# Altium project PCB_Project1.PrjPCB
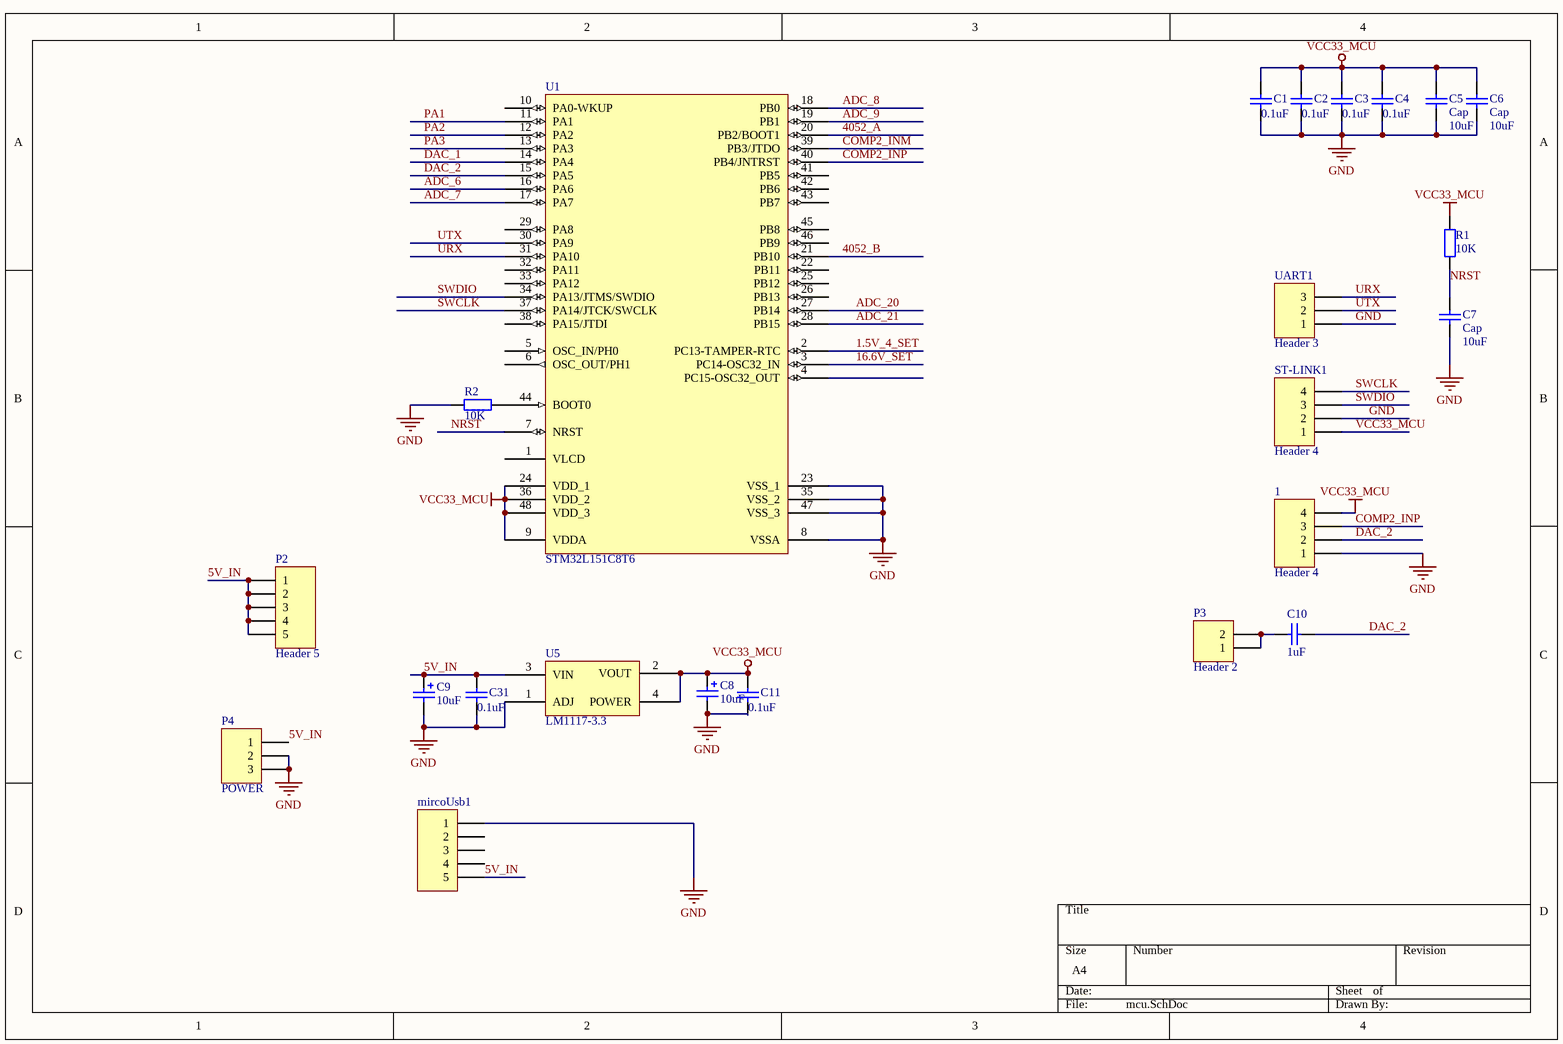
[diagram p0: mcu.SchDoc]
4 sheets, 110 parts. Net scope: global (net labels, ports and power ports of the same name join across sheets).
Board file: PCB1.PcbDoc
Sheets:
  mcu.SchDoc
  SIGNAL.SchDoc
  POWER.SchDoc
  NEW_POWER.SchDoc

## Sheet mcu.SchDoc
size A4

### Parts
1  Header 4  [HDR1X4]
C1  value 0.1uF  [c0805]  (hidden comment: Cap)
C2  value 0.1uF  [c0805]  (hidden comment: Cap)
C3  value 0.1uF  [c0805]  (hidden comment: Cap)
C4  value 0.1uF  [c0805]  (hidden comment: Cap)
C5  Cap  value 10uF  [c0805]
C6  Cap  value 10uF  [c0805]
C7  Cap  value 10uF  [c0805]
C8  value 10uF  [C1206]  (hidden comment: Cap Pol2)
C9  value 10uF  [C1206]  (hidden comment: Cap Pol2)
C10  value 1uF  [0805]  (hidden comment: Cap)
C11  value 0.1uF  [0805]  (hidden comment: Cap)
C31  value 0.1uF  [0805]  (hidden comment: Cap)
mircoUsb1  (no value)  [Micro_USB]
P2  Header 5  [HDR1X5]
P3  Header 2  [HDR1X2]
P4  POWER  [POWER_PLUG]
R1  value 10K  [0805]  (hidden comment: Res2)
R2  value 10K  [0805]  (hidden comment: Res2)
ST-LINK1  Header 4  [HDR1X4]
U1  STM32L151C8T6  [LQFP48_N]
U5  LM1117-3.3  [SOT223]
UART1  Header 3  [HDR1X3]

### Nets
GND: 1.1 C1.1 C2.1 C3.1 C4.1 C5.1 C6.1 C7.1 C8.2 C9.2 C11.1 C31.1 mircoUsb1.1 P4.2 P4.3 R2.1 ST-LINK1.2 U1.8(VSSA) U1.23(VSS_1) U1.35(VSS_2) U1.47(VSS_3) U5.1(ADJ) UART1.1
VCC33_MCU: 1.4 C1.2 C2.2 C3.2 C4.2 C5.2 C6.2 C8.1 C11.2 R1.1 ST-LINK1.1 U1.9(VDDA) U1.24(VDD_1) U1.36(VDD_2) U1.48(VDD_3) U5.2(VOUT) U5.4(POWER)
1.5V_4_SET: U1.2(PC13-TAMPER-RTC)
5V_IN: C9.1 C31.2 mircoUsb1.5 P2.1 P2.2 P2.3 P2.4 P2.5 P4.1 U5.3(VIN)
16.6V_SET: U1.3(PC14-OSC32_IN)
4052_A: U1.20(PB2/BOOT1)
4052_B: U1.21(PB10)
ADC_6: U1.16(PA6)
ADC_7: U1.17(PA7)
ADC_8: U1.18(PB0)
ADC_9: U1.19(PB1)
ADC_20: U1.27(PB14)
ADC_21: U1.28(PB15)
COMP2_INM: U1.39(PB3/JTDO)
COMP2_INP: 1.3 U1.40(PB4/JNTRST)
DAC_1: U1.14(PA4)
DAC_2: 1.2 C10.1 U1.15(PA5)
NRST: C7.2 R1.2 U1.7(NRST)
PA1: U1.11(PA1)
PA2: U1.12(PA2)
PA3: U1.13(PA3)
SWCLK: ST-LINK1.4 U1.37(PA14/JTCK/SWCLK)
SWDIO: ST-LINK1.3 U1.34(PA13/JTMS/SWDIO)
URX: U1.31(PA10) UART1.3
UTX: U1.30(PA9) UART1.2
NetC10_2: C10.2 P3.1 P3.2
NetR2_2: R2.2 U1.44(BOOT0)

Not connected (* = marked no-connect by the designer): mircoUsb1 2 3 4; U1 1(VLCD) 4(PC15-OSC32_OUT) 5(OSC_IN/PH0) 6(OSC_OUT/PH1) 10(PA0-WKUP) 22(PB11) 25(PB12) 26(PB13) 29(PA8) 32(PA11) 33(PA12) 38(PA15/JTDI) 41(PB5) 42(PB6) 43(PB7) 45(PB8) 46(PB9)

### Library data of the parts
1 ST-LINK1 = Header 4: Header, 4-Pin; LatestRevisionDate: 17-Jul-2002; LatestRevisionNote: Re-released for DXP Platform.; Publisher: Altium Limited
C1-C7 C10 C11 C31 = Cap: Capacitor; Published: 8-Jun-2000; LatestRevisionDate: 17-Jul-2002; LatestRevisionNote: Re-released for DXP Platform.; PackageReference: RAD-0.3; Publisher: Altium Limited
  C5-C7: PackageDescription: Radial Cap, Thru-Hole; 2 Leads; 0.3 in Pin Spacing
C8 C9 = Cap Pol2: Polarized Capacitor (Axial); Published: 8-Jun-2000; LatestRevisionDate: 17-Jul-2002; LatestRevisionNote: Re-released for DXP Platform.; PackageReference: POLAR0.8; Publisher: Altium Limited
mircoUsb1 P2 = Header 5: Header, 5-Pin; LatestRevisionDate: 17-Jul-2002; LatestRevisionNote: Re-released for DXP Platform.; Publisher: Altium Limited
P3 = Header 2: Header, 2-Pin; LatestRevisionDate: 17-Jul-2002; LatestRevisionNote: Re-released for DXP Platform.; Publisher: Altium Limited
R1 R2 = Res2: Resistor; Published: 8-Jun-2000; LatestRevisionDate: 17-Jul-2002; LatestRevisionNote: Re-released for DXP Platform.; PackageReference: AXIAL-0.4; Publisher: Altium Limited
U1 = STM32L151C8T6: STM32 ARM-based 32-bit MCU with 64 Kbytes Flash, 48-pin LQFP, Industrial Temperature; Published: 30-May-2008; DatasheetVersion: rev6, Mar-2008; PackageVersion: Mar-2008; PackageReference: LQFP48; Publisher: Altium Limited; PackageDescription: 48-Pin Low-Profile Quad Flat Pack, 7 x 7 mm Body, 0.5 mm Pitch (LQFP48); ComponentLink1Description: Manufacturer Link; ComponentLink1URL: www.st.com/stm32; ComponentLink2Description: Datasheet; ComponentLink2URL: http://www.st.com/stonline/products/literature/ds/13586.pdf
UART1 = Header 3: Header, 3-Pin; LatestRevisionDate: 17-Jul-2002; LatestRevisionNote: Re-released for DXP Platform.; Publisher: Altium Limited

## Sheet SIGNAL.SchDoc
size A4
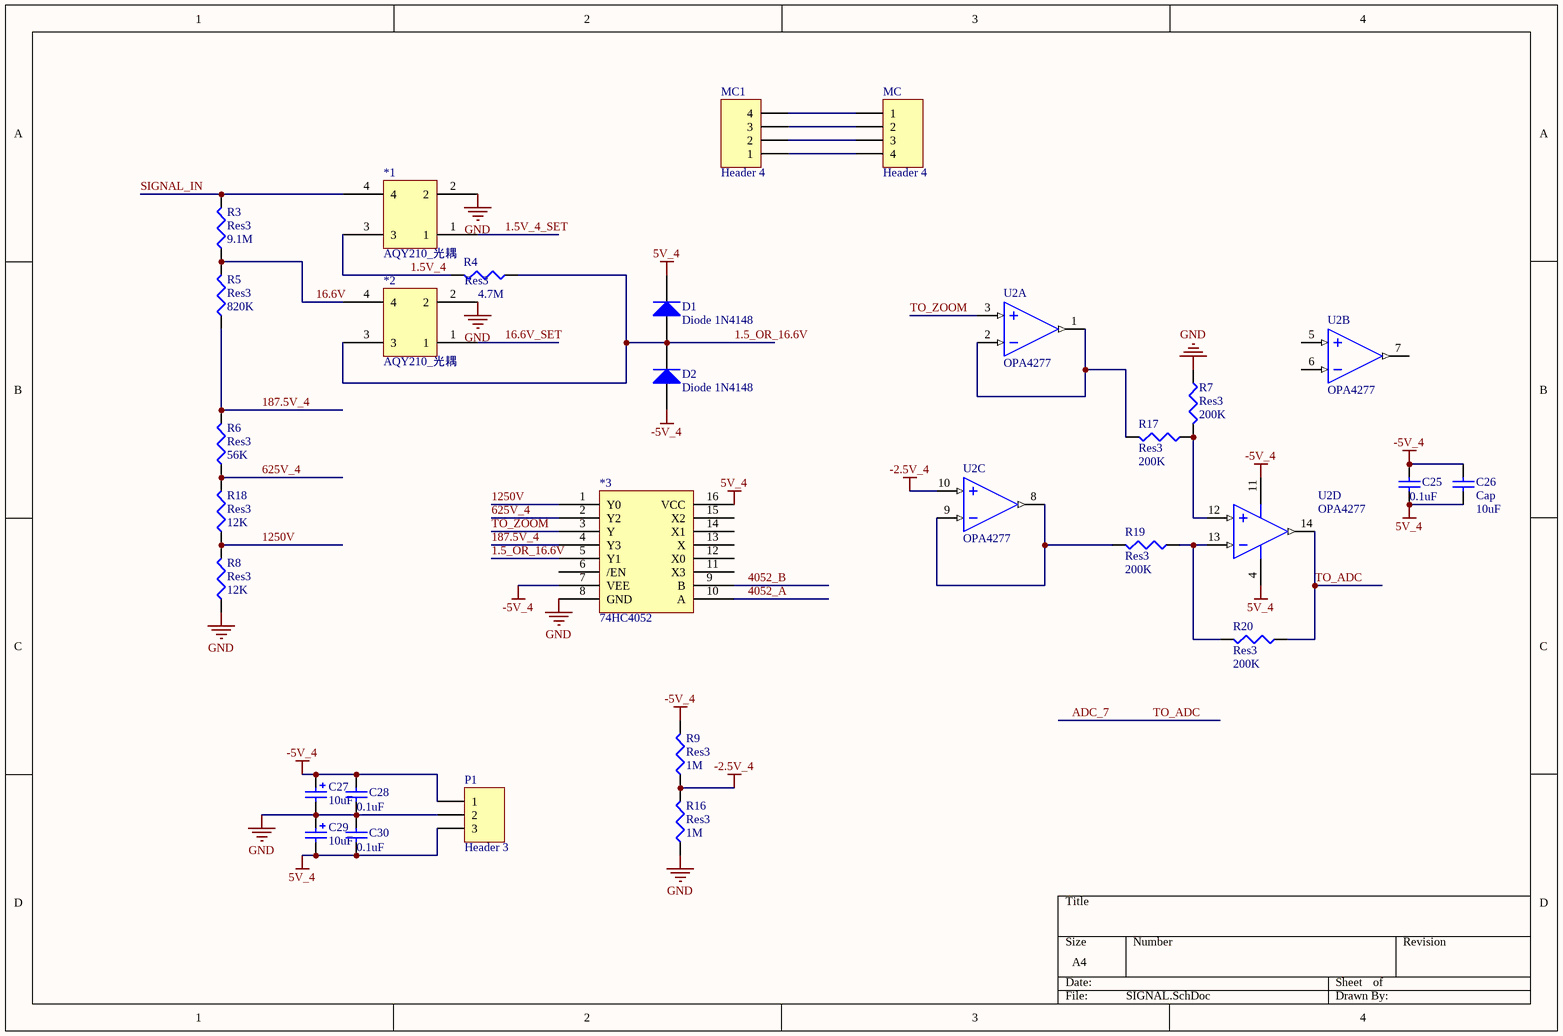
[diagram p1: SIGNAL.SchDoc]

### Parts
*1  AQY210_光耦  [SOT254P605X218-4N]
*2  AQY210_光耦  [SOT254P605X218-4N]
*3  74HC4052  [SOP-16]
C25  value 0.1uF  [c0805]  (hidden comment: Cap)
C26  Cap  value 10uF  [c0805]
C27  value 10uF  [C1206]  (hidden comment: Cap Pol2)
C28  value 0.1uF  [0805]  (hidden comment: Cap)
C29  value 10uF  [C1206]  (hidden comment: Cap Pol2)
C30  value 0.1uF  [0805]  (hidden comment: Cap)
D1  Diode 1N4148  [0805]
D2  Diode 1N4148  [0805]
MC  Header 4  [PCBComponent_1]
MC1  Header 4  [HDR1X4]
P1  Header 3  [HDR1X3]
R3  Res3  value 9.1M  [0805]
R4  Res3  value 4.7M  [0805]
R5  Res3  value 820K  [0805]
R6  Res3  value 56K  [0805]
R7  Res3  value 200K  [0805]
R8  Res3  value 12K  [0805]
R9  Res3  value 1M  [0805]
R16  Res3  value 1M  [0805]
R17  Res3  value 200K  [0805]
R18  Res3  value 12K  [0805]
R19  Res3  value 200K  [0805]
R20  Res3  value 200K  [0805]
U2  OPA4277  [SO-14]  (parts A,B,C,D of 4)

### Nets
5V_4: *3.16(VCC) C25.1 C26.1 C29.2 C30.1 D1.2(K) P1.3 U2.4(V+)
-2.5V_4: R9.1 R16.2 U2.10(IN+)
-5V_4: *3.7(VEE) C25.2 C26.2 C27.1 C28.2 D2.1(A) P1.1 R9.2 U2.11(V-)
GND: *1.2 *2.2 *3.8(GND) C27.2 C28.1 C29.1 C30.2 P1.2 R7.1 R8.1 R16.1
1.5_OR_16.6V: *2.3 *3.5(Y1) D1.1(A) D2.2(K) R4.1
1.5V_4: *1.3 R4.2
1.5V_4_SET: *1.1
16.6V: *2.4 R3.1 R5.2
16.6V_SET: *2.1
187.5V_4: *3.4(Y3) R5.1 R6.2
625V_4: *3.2(Y2) R6.1 R18.2
1250V: *3.1(Y0) R8.2 R18.1
4052_A: *3.10(A)
4052_B: *3.9(B)
ADC_7: R20.1 U2.14(OUT)  [also labelled TO_ADC]
SIGNAL_IN: *1.4 R3.2
TO_ZOOM: *3.3(Y) U2.3(IN+)
NetMC_1: MC.1 MC1.4
NetMC_2: MC.2 MC1.3
NetMC_3: MC.3 MC1.2
NetMC_4: MC.4 MC1.1
NetR7_2: R7.2 R17.1 U2.12(IN+)
NetR17_2: R17.2 U2.1(OUT) U2.2(IN-)
NetR19_1: R19.1 R20.2 U2.13(IN-)
NetR19_2: R19.2 U2.8(OUT) U2.9(IN-)

Not connected (* = marked no-connect by the designer): *3 6(/EN) 11(X3) 12(X0) 13(X) 14(X1) 15(X2); U2 5(IN+) 6(IN-) 7(OUT)

### Library data of the parts
*1 *2 = AQY210_光耦: AQY210
C25 C26 C28 C30 = Cap: Capacitor; Published: 8-Jun-2000; LatestRevisionDate: 17-Jul-2002; LatestRevisionNote: Re-released for DXP Platform.; PackageReference: RAD-0.3; Publisher: Altium Limited
  C26: PackageDescription: Radial Cap, Thru-Hole; 2 Leads; 0.3 in Pin Spacing
C27 C29 = Cap Pol2: Polarized Capacitor (Axial); Published: 8-Jun-2000; LatestRevisionDate: 17-Jul-2002; LatestRevisionNote: Re-released for DXP Platform.; PackageReference: POLAR0.8; Publisher: Altium Limited
D1 D2 = Diode 1N4002: 1 Amp General Purpose Rectifier; Published: 8-Jun-2000; LatestRevisionDate: 17-Jul-2002; LatestRevisionNote: Re-released for DXP Platform.; DatasheetVersion: 1998; PackageVersion: Aug-1999; PackageReference: DO-41; Publisher: Altium Limited; PackageDescription: Diode, Axial; Body 5.2 x 2.7 mm (LxDia. max), Lead Dia. 0.86 mm (max); Code_JEDEC: DO-204-AL; ComponentLink1Description: Manufacturer Link; ComponentLink1URL: http://www.fairchildsemi.com/; ComponentLink2Description: Datasheet; ComponentLink2URL: http://www.fairchildsemi.com/ds/1N%2F1N4001.pdf
MC MC1 = Header 4: Header, 4-Pin; LatestRevisionDate: 17-Jul-2002; LatestRevisionNote: Re-released for DXP Platform.; Publisher: Altium Limited
P1 = Header 3: Header, 3-Pin; LatestRevisionDate: 17-Jul-2002; LatestRevisionNote: Re-released for DXP Platform.; Publisher: Altium Limited
R3-R9 R16-R20 = Res3: Resistor; Published: 8-Jun-2000; LatestRevisionDate: 29-May-2009; LatestRevisionNote: IPC-7351 Footprint Added.; PackageReference: J1-0603; Publisher: Altium Limited; PackageDescription: Chip Resistor
U2 = OPA4277: High Precision Operational Amplifiers; Text Field7: Published 8-Jun-2000

## Sheet POWER.SchDoc
size A4
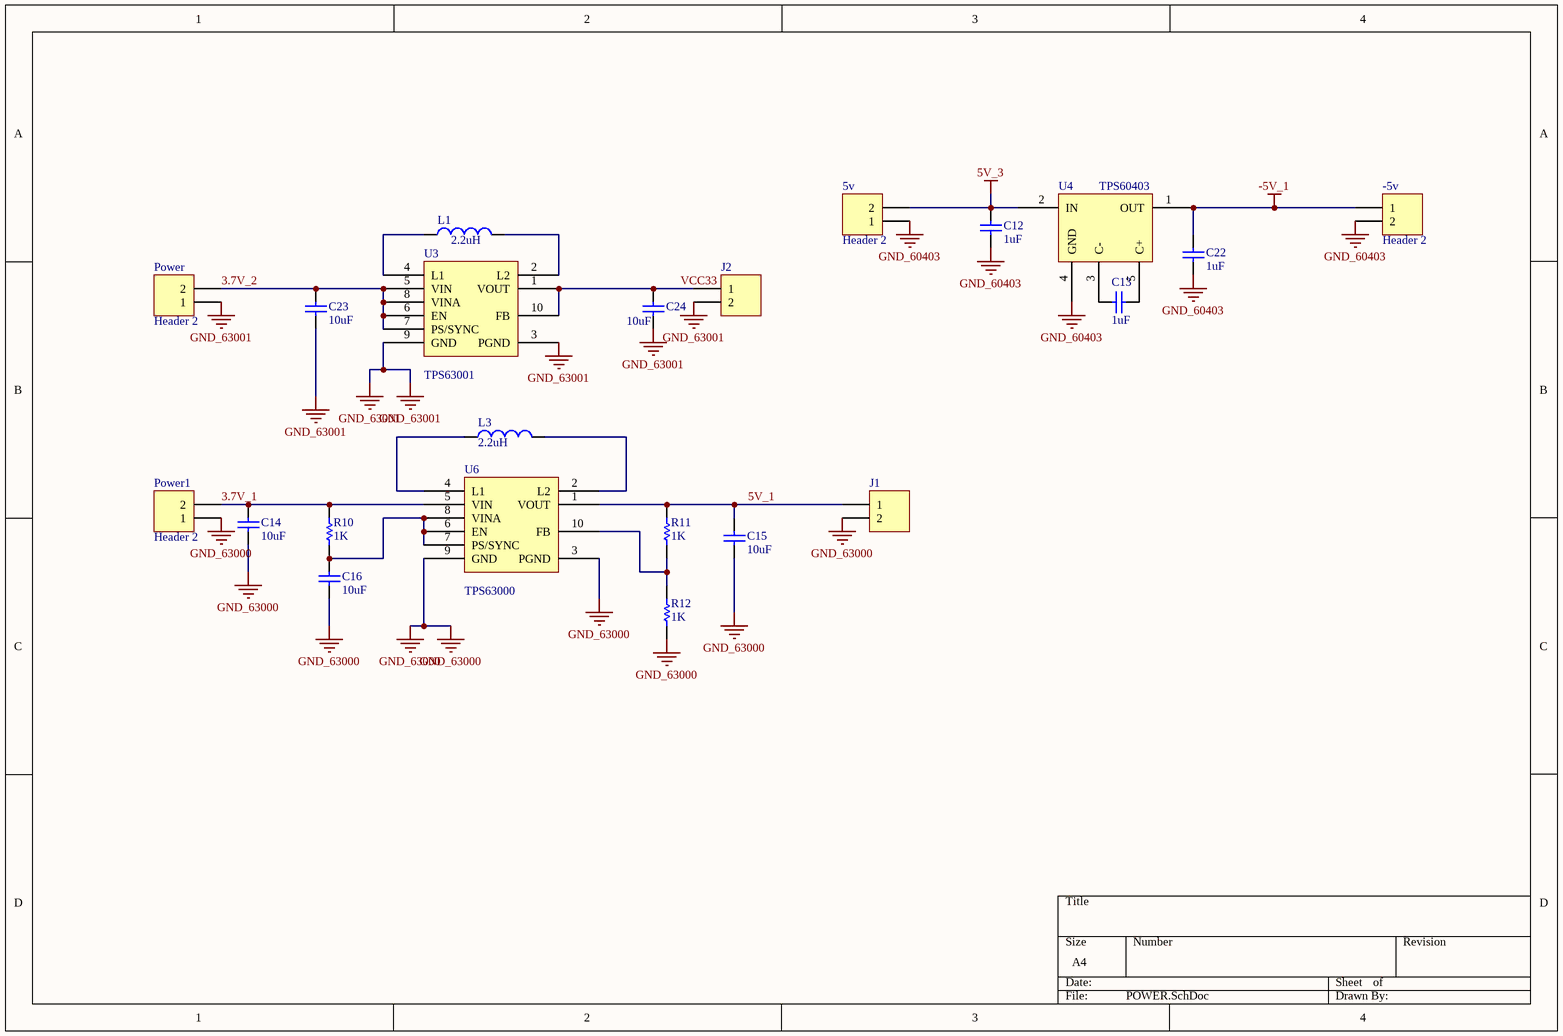
[diagram p2: POWER.SchDoc]

### Parts
5v  Header 2  [HDR1X2]
-5v  Header 2  [HDR1X2]
C12  value 1uF  [PCBComponent_1]
C13  value 1uF  [PCBComponent_1]
C14  value 10uF  [PCBComponent_1]
C15  value 10uF  [PCBComponent_1]
C16  value 10uF  [PCBComponent_1]
C22  value 1uF  [PCBComponent_1]
C23  value 10uF  [PCBComponent_1]
C24  value 10uF  [PCBComponent_1]
J1  (no value)  [HDR1X2]
J2  (no value)  [HDR1X2]
L1  value 2.2uH  [INDP7474X40N]
L3  value 2.2uH  [INDP7474X40N]
Power  Header 2  [HDR1X2]
Power1  Header 2  [HDR1X2]
R10  value 1K  [2012[0805]]
R11  value 1K  [2012[0805]]
R12  value 1K  [2012[0805]]
U3  TPS63001  [QFN50P300X300X95-10M]
U4  TPS60403  [SOT95P280X110-5N]
U6  TPS63000  [QFN50P300X300X95-10M]

### Nets
5V_3: 5v.2 C12.1 U4.2(IN)
-5V_1: -5v.1 C22.1 U4.1(OUT)
GND_60403: 5v.1 -5v.2 C12.2 C22.2 U4.4(GND)
GND_63000: C14.1 C15.1 C16.1 J1.2 Power1.1 R12.1 U6.3(PGND) U6.9(GND)
GND_63001: C23.1 C24.1 J2.2 Power.1 U3.3(PGND) U3.9(GND)
3.7V_1: C14.2 Power1.2 R10.2 U6.5(VIN)
3.7V_2: C23.2 Power.2 U3.5(VIN) U3.6(EN) U3.7(PS/SYNC) U3.8(VINA)
5V_1: C15.2 J1.1 R11.2 U6.1(VOUT)
VCC33: C24.2 J2.1 U3.1(VOUT) U3.10(FB)
NetC13_1: C13.1 U4.5(C+)
NetC13_2: C13.2 U4.3(C-)
NetC16_2: C16.2 R10.1 U6.6(EN) U6.7(PS/SYNC) U6.8(VINA)
NetL1_1: L1.1 U3.4(L1)
NetL1_2: L1.2 U3.2(L2)
NetL3_1: L3.1 U6.4(L1)
NetL3_2: L3.2 U6.2(L2)
NetR11_1: R11.1 R12.2 U6.10(FB)

### Library data of the parts
5v -5v J1 J2 Power Power1 = Header 2: Header, 2-Pin; LatestRevisionDate: 17-Jul-2002; LatestRevisionNote: Re-released for DXP Platform.; Publisher: Altium Limited
C12-C16 C22-C24 = Cap Semi: Capacitor (Semiconductor SIM Model); Published: 8-Jun-2000; LatestRevisionDate: 17-Jul-2002; LatestRevisionNote: Re-released for DXP Platform.; PackageReference: C1206; Publisher: Altium Limited
L1 L3 = Inductor: Code_IEC: 1005; Published: 8-Jun-2000; LatestRevisionDate: 17-Jul-2002; LatestRevisionNote: Re-released for DXP Platform.; PackageReference: 0402-A; Publisher: Altium Limited; Code_JEITA: 0402
R10-R12 = Res Semi: Semiconductor Resistor; Published: 8-Jun-2000; LatestRevisionDate: 17-Jul-2002; LatestRevisionNote: Re-released for DXP Platform.; PackageReference: AXIAL-0.5; Publisher: Altium Limited
U3 U4 U6 = Component_1

## Sheet NEW_POWER.SchDoc
size A4
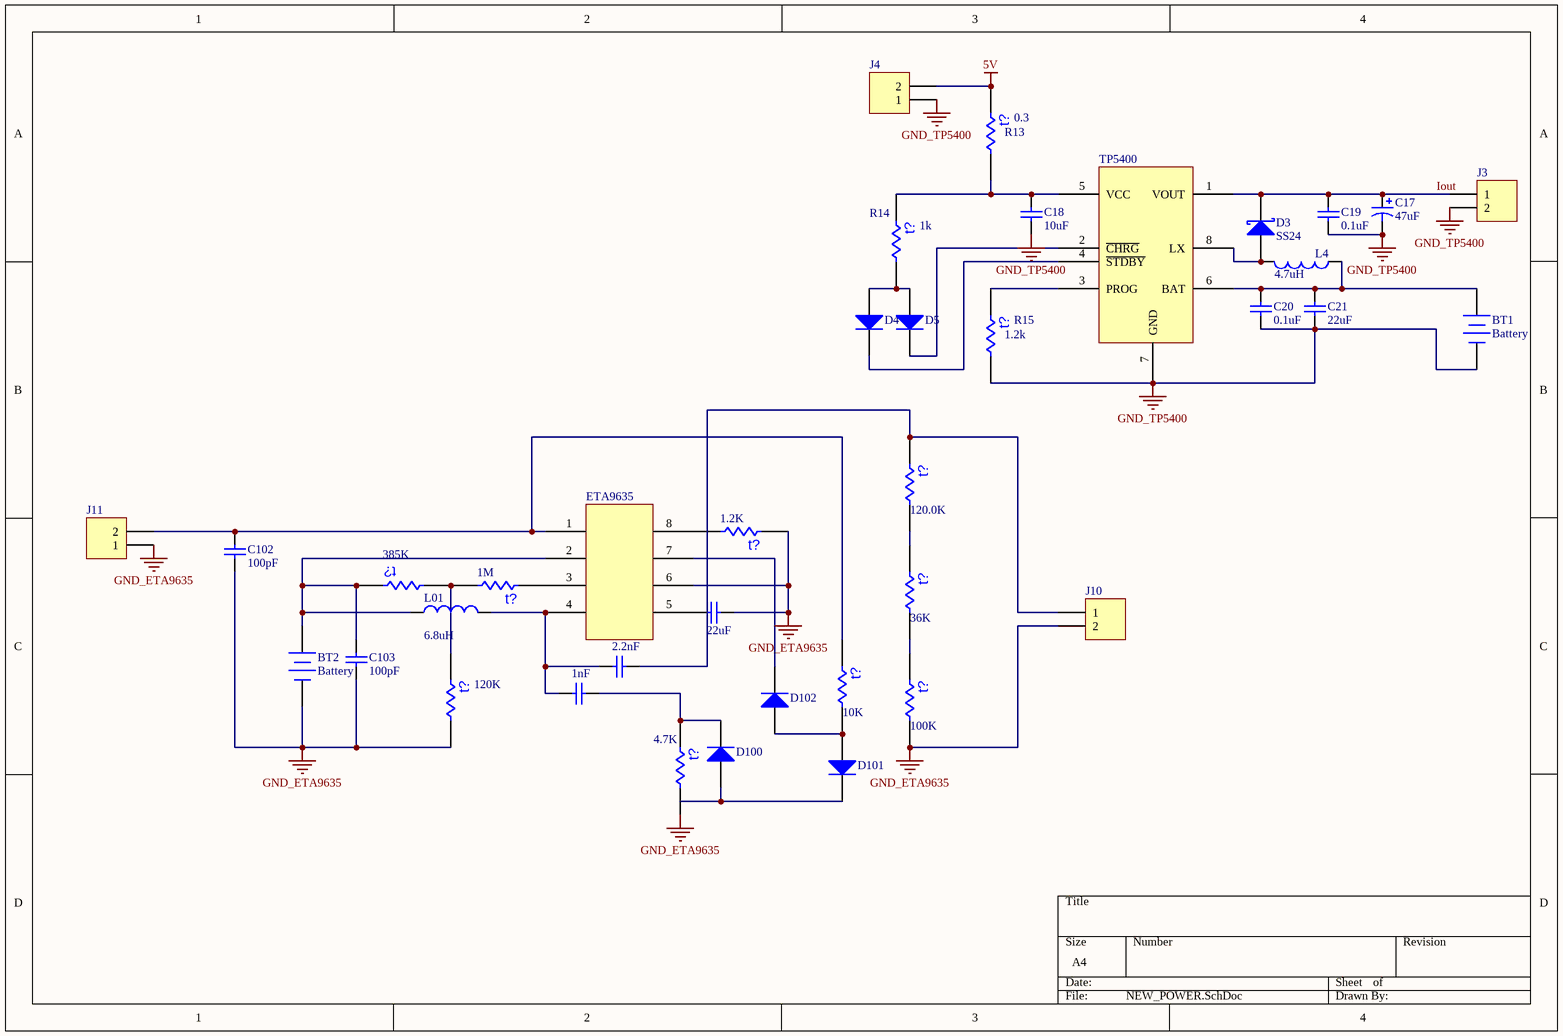
[diagram p3: NEW_POWER.SchDoc]

### Parts
1.2K  (no value)  [6-0805]
1M  (no value)  [6-0805]
1nF  (no value)  [PCBComponent_1]
2.2nF  (no value)  [PCBComponent_1]
4.7K  (no value)  [6-0805]
10K  (no value)  [6-0805]
36K  (no value)  [6-0805]
100K  (no value)  [6-0805]
120.0K  (no value)  [6-0805]
120K  (no value)  [6-0805]
385K  (no value)  [6-0805]
BT1  Battery  [BAT-2]
BT2  Battery  [BAT-2]
C17  value 47uF  [3225[1210]]
C18  value 10uF  [PCBComponent_1]
C19  value 0.1uF  [PCBComponent_1]
C20  value 0.1uF  [PCBComponent_1]
C21  value 22uF  [C1210]
C102  value 100pF  [PCBComponent_1]
C103  value 100pF  [PCBComponent_1]
D3  SS24  [CAPM4227X18N]
D4  (no value)  [PCBComponent_1]
D5  (no value)  [PCBComponent_1]
D100  (no value)  [PCBComponent_1]
D101  (no value)  [PCBComponent_1]
D102  (no value)  [PCBComponent_1]
ETA9635  (no value)  [SOP-8]
J3  (no value)  [HDR1X2]
J4  (no value)  [HDR1X2]
J10  (no value)  [HDR1X2]
J11  (no value)  [HDR1X2]
L01  value 6.8uH  [INDP7474X40N]
L4  value 4.7uH  [INDP7474X40N]
R13  0.3  [6-0805]
R14  1k  [6-0805]
R15  1.2k  [6-0805]
TP5400  (no value)  [SOP127P600X175-8N]
  value 22uF  [PCBComponent_1]

### Nets
5V: J4.2 R13.1
GND_ETA9635: 1.2K.1 4.7K.2 100K.2 120K.2 BT2.2(-) C102.1 C103.1 ETA9635.6 J10.2 J11.1 .1
GND_TP5400: BT1.2(-) C17.2 C18.1 C19.1 C20.1 C21.1 J3.2 J4.1 R15.2 TP5400.7(GND)
Iout: C17.1 C19.2 D3.2(K) J3.1 TP5400.1(VOUT)
Net1.2K_2: 1.2K.2 ETA9635.8
Net1M_1: 1M.1 ETA9635.3
Net1M_2: 1M.2 120K.1 385K.2
Net1nF_1: 1nF.1 2.2nF.1 ETA9635.4 L01.2
Net1nF_2: 1nF.2 4.7K.1 D100.2(K)
Net2.2nF_2: 2.2nF.2 120.0K.1 J10.1
Net10K_1: 10K.1 C102.2 ETA9635.1 J11.2
Net10K_2: 10K.2 D101.1(A) D102.1(A)
Net36K_1: 36K.1 120.0K.2
Net36K_2: 36K.2 100K.1
Net385K_1: 385K.1 BT2.1(+) C103.2 ETA9635.2 L01.1
NetBT1_1: BT1.1(+) C20.2 C21.2 L4.1 TP5400.6(BAT)
NetC18_2: C18.2 R13.2 R14.1 TP5400.5(VCC)
NetD3_1: D3.1(A) L4.2 TP5400.8(LX)
NetD4_1: D4.1(A) D5.1(A) R14.2
NetD4_2: D4.2(K) TP5400.4(~{STDBY})
NetD5_2: D5.2(K) TP5400.2(~{CHRG})
NetD100_1: D100.1(A) D101.2(K)
NetD102_2: D102.2(K) ETA9635.7
NetETA9635_5: ETA9635.5 .2
NetR15_1: R15.1 TP5400.3(PROG)

### Notes on the sheet
- (in symbol Res Thermal) t?

### Library data of the parts
1.2K 1M 4.7K 10K 36K 100K 120.0K 120K 385K = Res Thermal: Thermistor; Published: 24-Mar-1999; LatestRevisionDate: 04-Mar-2005; LatestRevisionNote: PCB Footprint replaced.; PackageReference: 6-0805; Publisher: Altium Limited
1nF 2.2nF C18-C21 C102 C103  = Cap Semi: Capacitor (Semiconductor SIM Model); Published: 8-Jun-2000; LatestRevisionDate: 17-Jul-2002; LatestRevisionNote: Re-released for DXP Platform.; PackageReference: C1206; Publisher: Altium Limited
BT1 BT2 = Battery: Multicell Battery; Published: 24-Mar-1999; LatestRevisionDate: 17-Jul-2002; LatestRevisionNote: Re-released for DXP Platform.; PackageReference: BAT-2; Publisher: Altium Limited
C17 = Cap Pol3: Polarized Capacitor (Surface Mount); Published: 8-Jun-2000; LatestRevisionDate: 17-Jul-2002; LatestRevisionNote: Re-released for DXP Platform.; PackageReference: C0805; Publisher: Altium Limited
D3 = Diode 11DQ03: Schottky Rectifier; Published: 8-Jun-2000; LatestRevisionDate: 17-Jul-2002; LatestRevisionNote: Re-released for DXP Platform.; DatasheetDocument: Dec-1997; PackageReference: DO-204AL; Publisher: Altium Limited; Code_JEDEC: DO-204-AL; ComponentLink1Description: Manufacturer Link; ComponentLink1URL: http://www.irf.com/; ComponentLink2Description: Datasheet; ComponentLink2URL: http://www.irf.com/product-info/datasheets/data/11dq03.pdf
D4 D5 D100-D102 = Diode 1N4005: 1 Amp General Purpose Rectifier; Published: 8-Jun-2000; LatestRevisionDate: 17-Jul-2002; LatestRevisionNote: Re-released for DXP Platform.; DatasheetDocument: 1998; PackageDocument: Aug-1999; PackageReference: DO-41; Publisher: Altium Limited; Code_JEDEC: DO-204-AL; ComponentLink1Description: Manufacturer Link; ComponentLink1URL: http://www.fairchildsemi.com/; ComponentLink2Description: Datasheet; ComponentLink2URL: http://www.fairchildsemi.com/ds/1N%2F1N4001.pdf
ETA9635 TP5400 = Component_1
J3 J4 J10 J11 = Header 2: Header, 2-Pin; LatestRevisionDate: 17-Jul-2002; LatestRevisionNote: Re-released for DXP Platform.; Publisher: Altium Limited
L01 L4 = Inductor: Code_IEC: 1005; Published: 8-Jun-2000; LatestRevisionDate: 17-Jul-2002; LatestRevisionNote: Re-released for DXP Platform.; PackageReference: 0402-A; Publisher: Altium Limited; Code_JEITA: 0402
R13-R15 = Res Thermal: Published: 24-Mar-1999; LatestRevisionDate: 04-Mar-2005; LatestRevisionNote: PCB Footprint replaced.; PackageReference: 6-0805; Publisher: Altium Limited

## Nets that join several sheets
GND: mcu (23 pins), SIGNAL (11 pins)
1.5V_4_SET: mcu (U1.2), SIGNAL (*1.1)
16.6V_SET: mcu (U1.3), SIGNAL (*2.1)
4052_A: mcu (U1.20), SIGNAL (*3.10)
4052_B: mcu (U1.21), SIGNAL (*3.9)
ADC_7: mcu (U1.17), SIGNAL (R20.1 U2.14)